# Altium schematic sheet Amplifier89.SchDoc
size A4
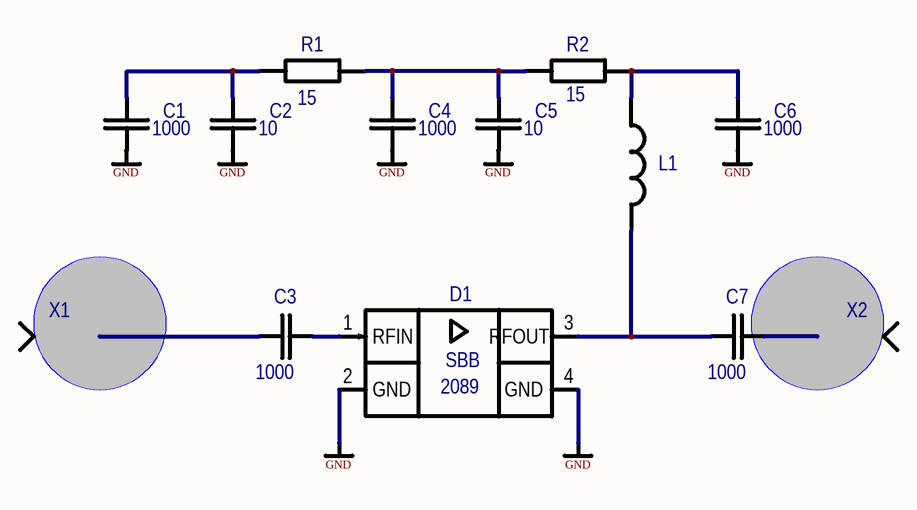
[diagram p0: Amplifier89.SchDoc]

## Parts
(Parts that share a designator on the sheet are numbered #1, #2 ... from top to bottom, then left to right.)
*#1  GND  (value not drawn)  (graphical)
*#2  GND  (value not drawn)  (graphical)
*#3  GND  (value not drawn)  (graphical)
*#4  GND  (value not drawn)  (graphical)
*#5  GND  (value not drawn)  (graphical)
*#6  GND  (value not drawn)  (graphical)
*#7  GND  (value not drawn)  (graphical)
C1  1000  [CAPC1005N]
C2  10  [CAPC1005N]
C3  1000  [CAPC1005N]
C4  1000  [CAPC1005N]
C5  10  [CAPC1005N]
C6  1000  [CAPC1005N]
C7  1000  [CAPC1005N]
D1  SBB2089Z  [SOT89-150P400X160-3N]  (value not drawn)
L1  (no value)  [INDC2012X16N]
R1  15  [RESC2012L]
R2  15  [RESC2012L]
X1  22_SMA-50-0-15/111_NE  [TP0.8X1.5]  (value not drawn)
X2  22_SMA-50-0-15/111_NE  [TP0.8X1.5]  (value not drawn)

## Nets
GND: C1.1 C2.1 C4.1 C5.1 C6.1 D1.2(GND) D1.4(GND)
NetC1_2: C1.2 C2.2 R1.1
NetC3_1: C3.1 X1.1
NetC3_2: C3.2 D1.1(RFIN)
NetC4_2: C4.2 C5.2 R1.2 R2.1
NetC6_2: C6.2 L1.1 R2.2
NetC7_1: C7.1 D1.3(RFOUT) L1.2
NetC7_2: C7.2 X2.1

## Notes on the sheet
- (in symbol SBB2089Z) SBB; 2089

## Library data of the parts
*#1-*#7 = GND: Корпус ЕСКД. Для "наложения" на штатный Power Bar
C1-C7 = C0402: Чип-конденсатор; Name: 0402; Power/Voltage: {Voltage}; TKE/TKC: {TKE/TKC}; Tolerance: {Tolerance}; Value: {Value}; BCPId: *; Manufacturer: *; ManufacturerPartNumber: *; Type: Конденсатор
D1 = SBB2089Z: 0.05-6 GHz Amplifier; Manufacturer: RFMD; Type: Микросхема; BCPId: *; Name: *; Package: SOT89; ManufacturerPartNumber: SBB2089Z
L1 = L0805CS: Индуктивность без магнитопровода; Manufacturer: Coilcraft; ManufacturerPartNumber: 0805CS; Name: 0805; BCPId: *; Type: Индуктивность; Power/Voltage: *; TU/GOST: *
R1 R2 = R0805: Чип-резистор; Name: 0805; Tolerance: {Tolerance}; Value: {Value}; BCPId: *; Manufacturer: *; ManufacturerPartNumber: *; Type: Резистор
X1 X2 = 22_SMA-50-0-15/111_NE: Розетка герметичная; Manufacturer: HUBER+SUHNER; BCPId: *; ManufacturerPartNumber: 22_SMA-50-0-15/111_NE; Type: Розетка